# EAGLE design sanguish 2 (EAGLE 6.2)
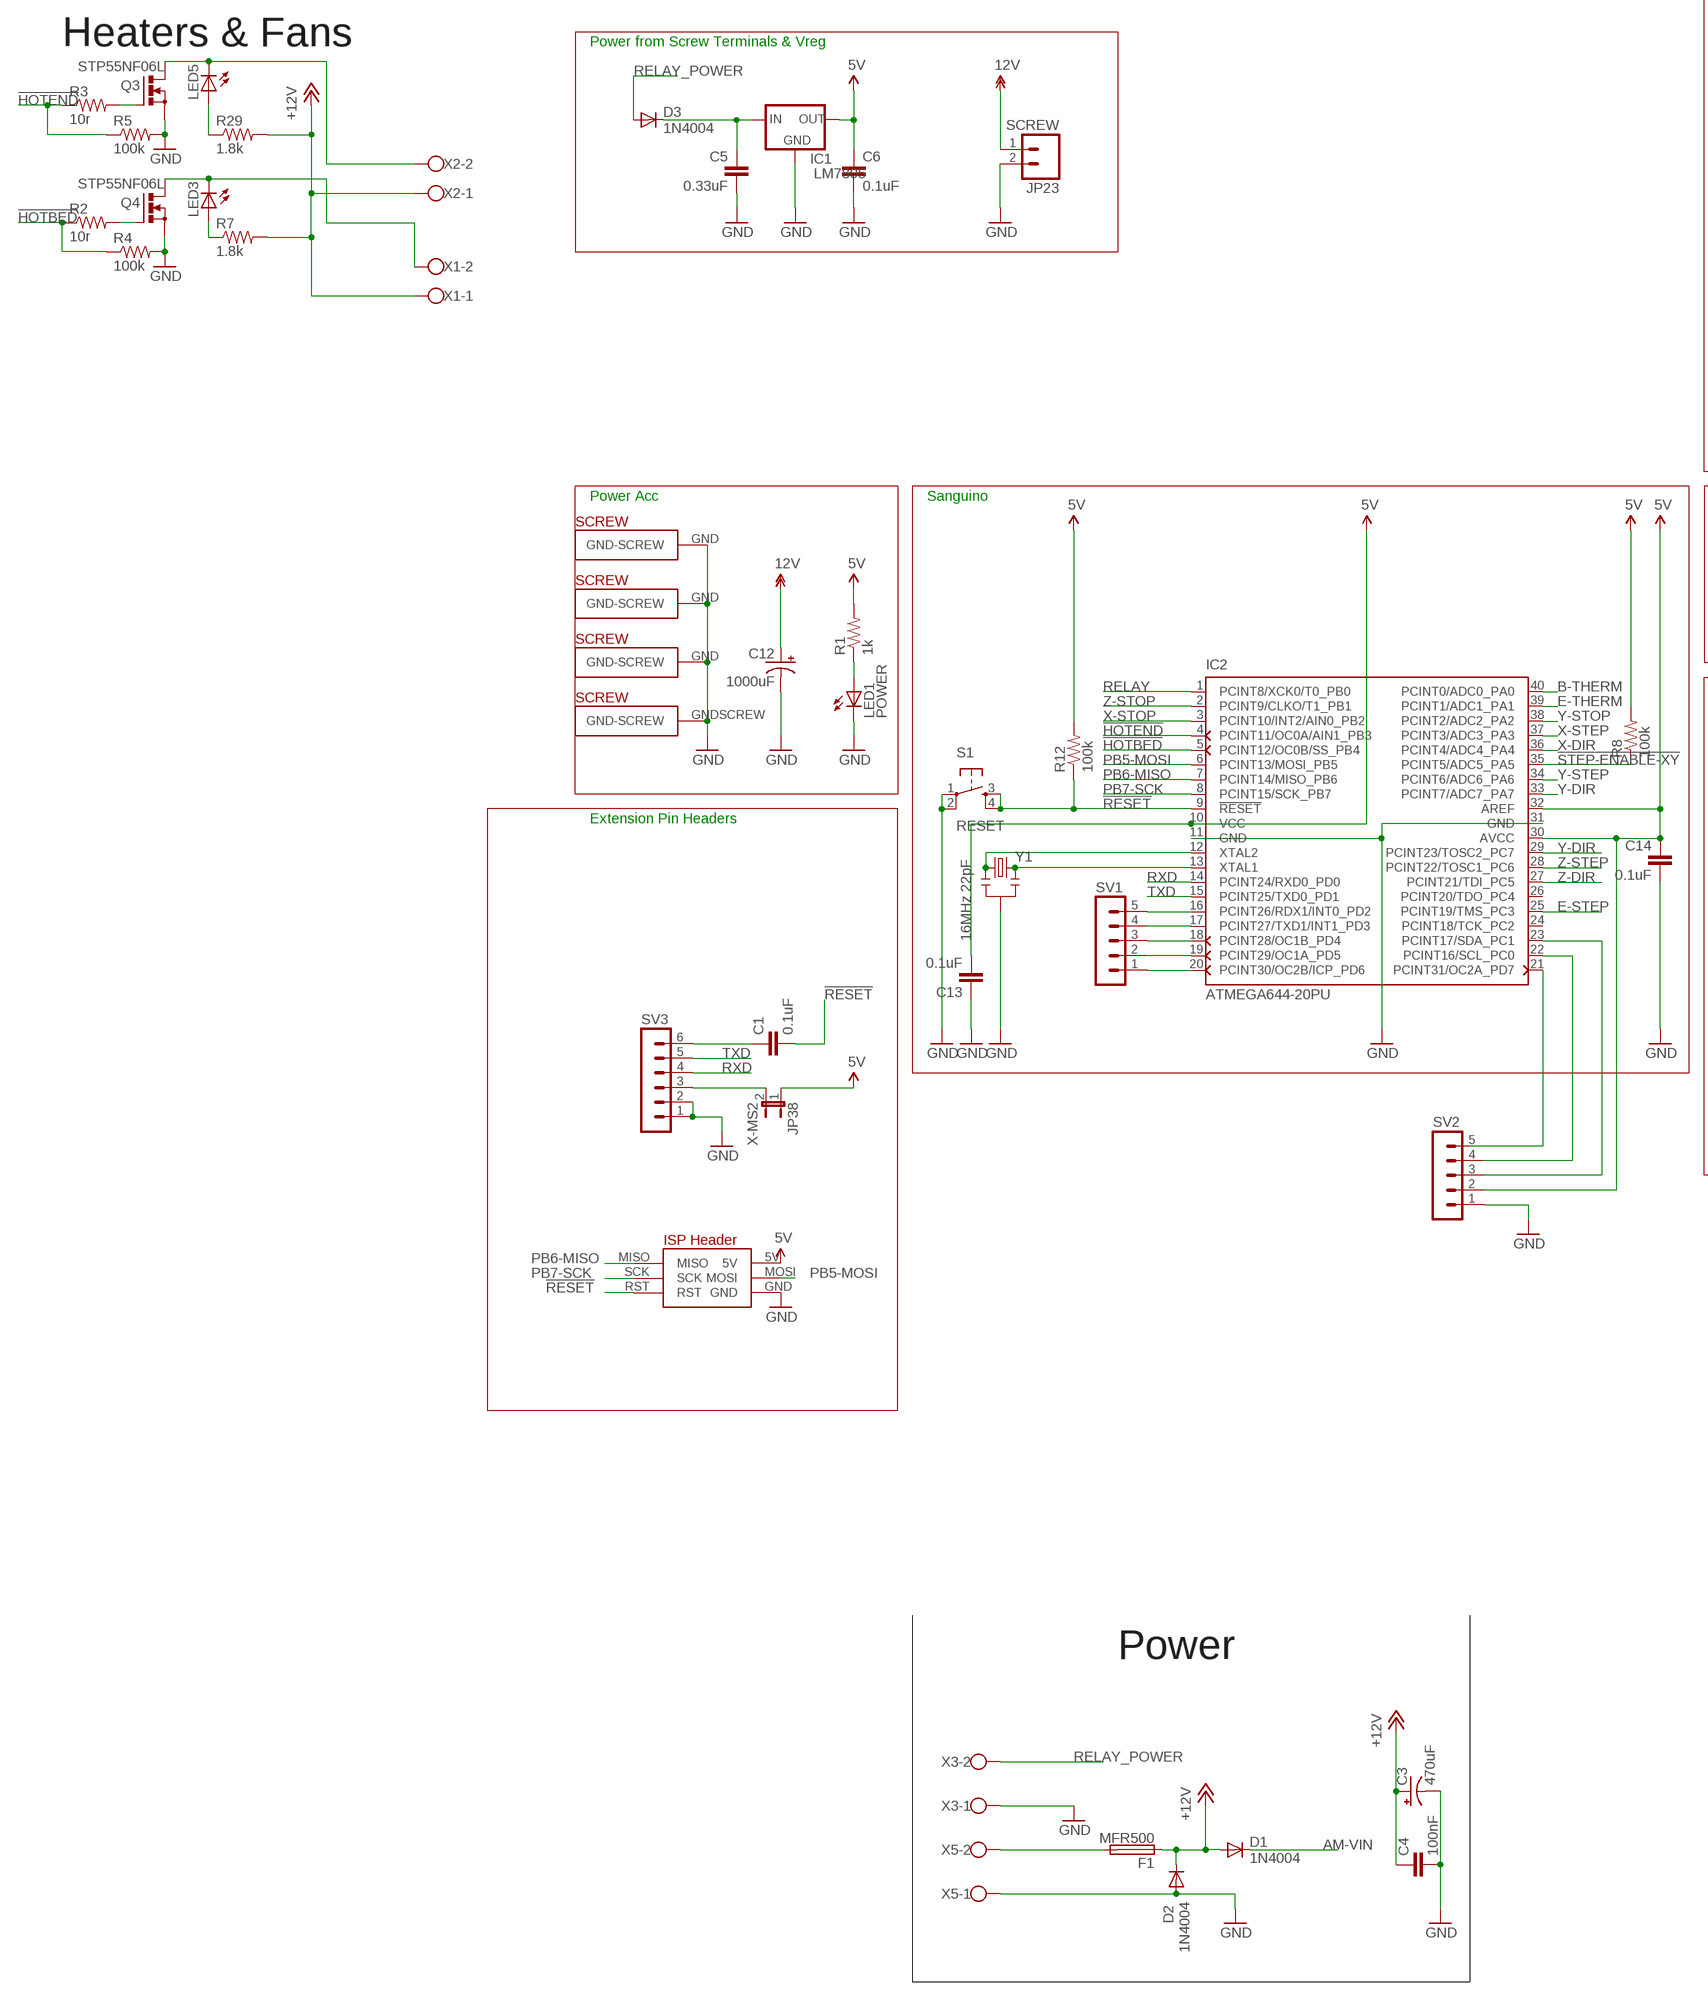
[diagram p0: schematic, sheet 1, part 1 of 2]
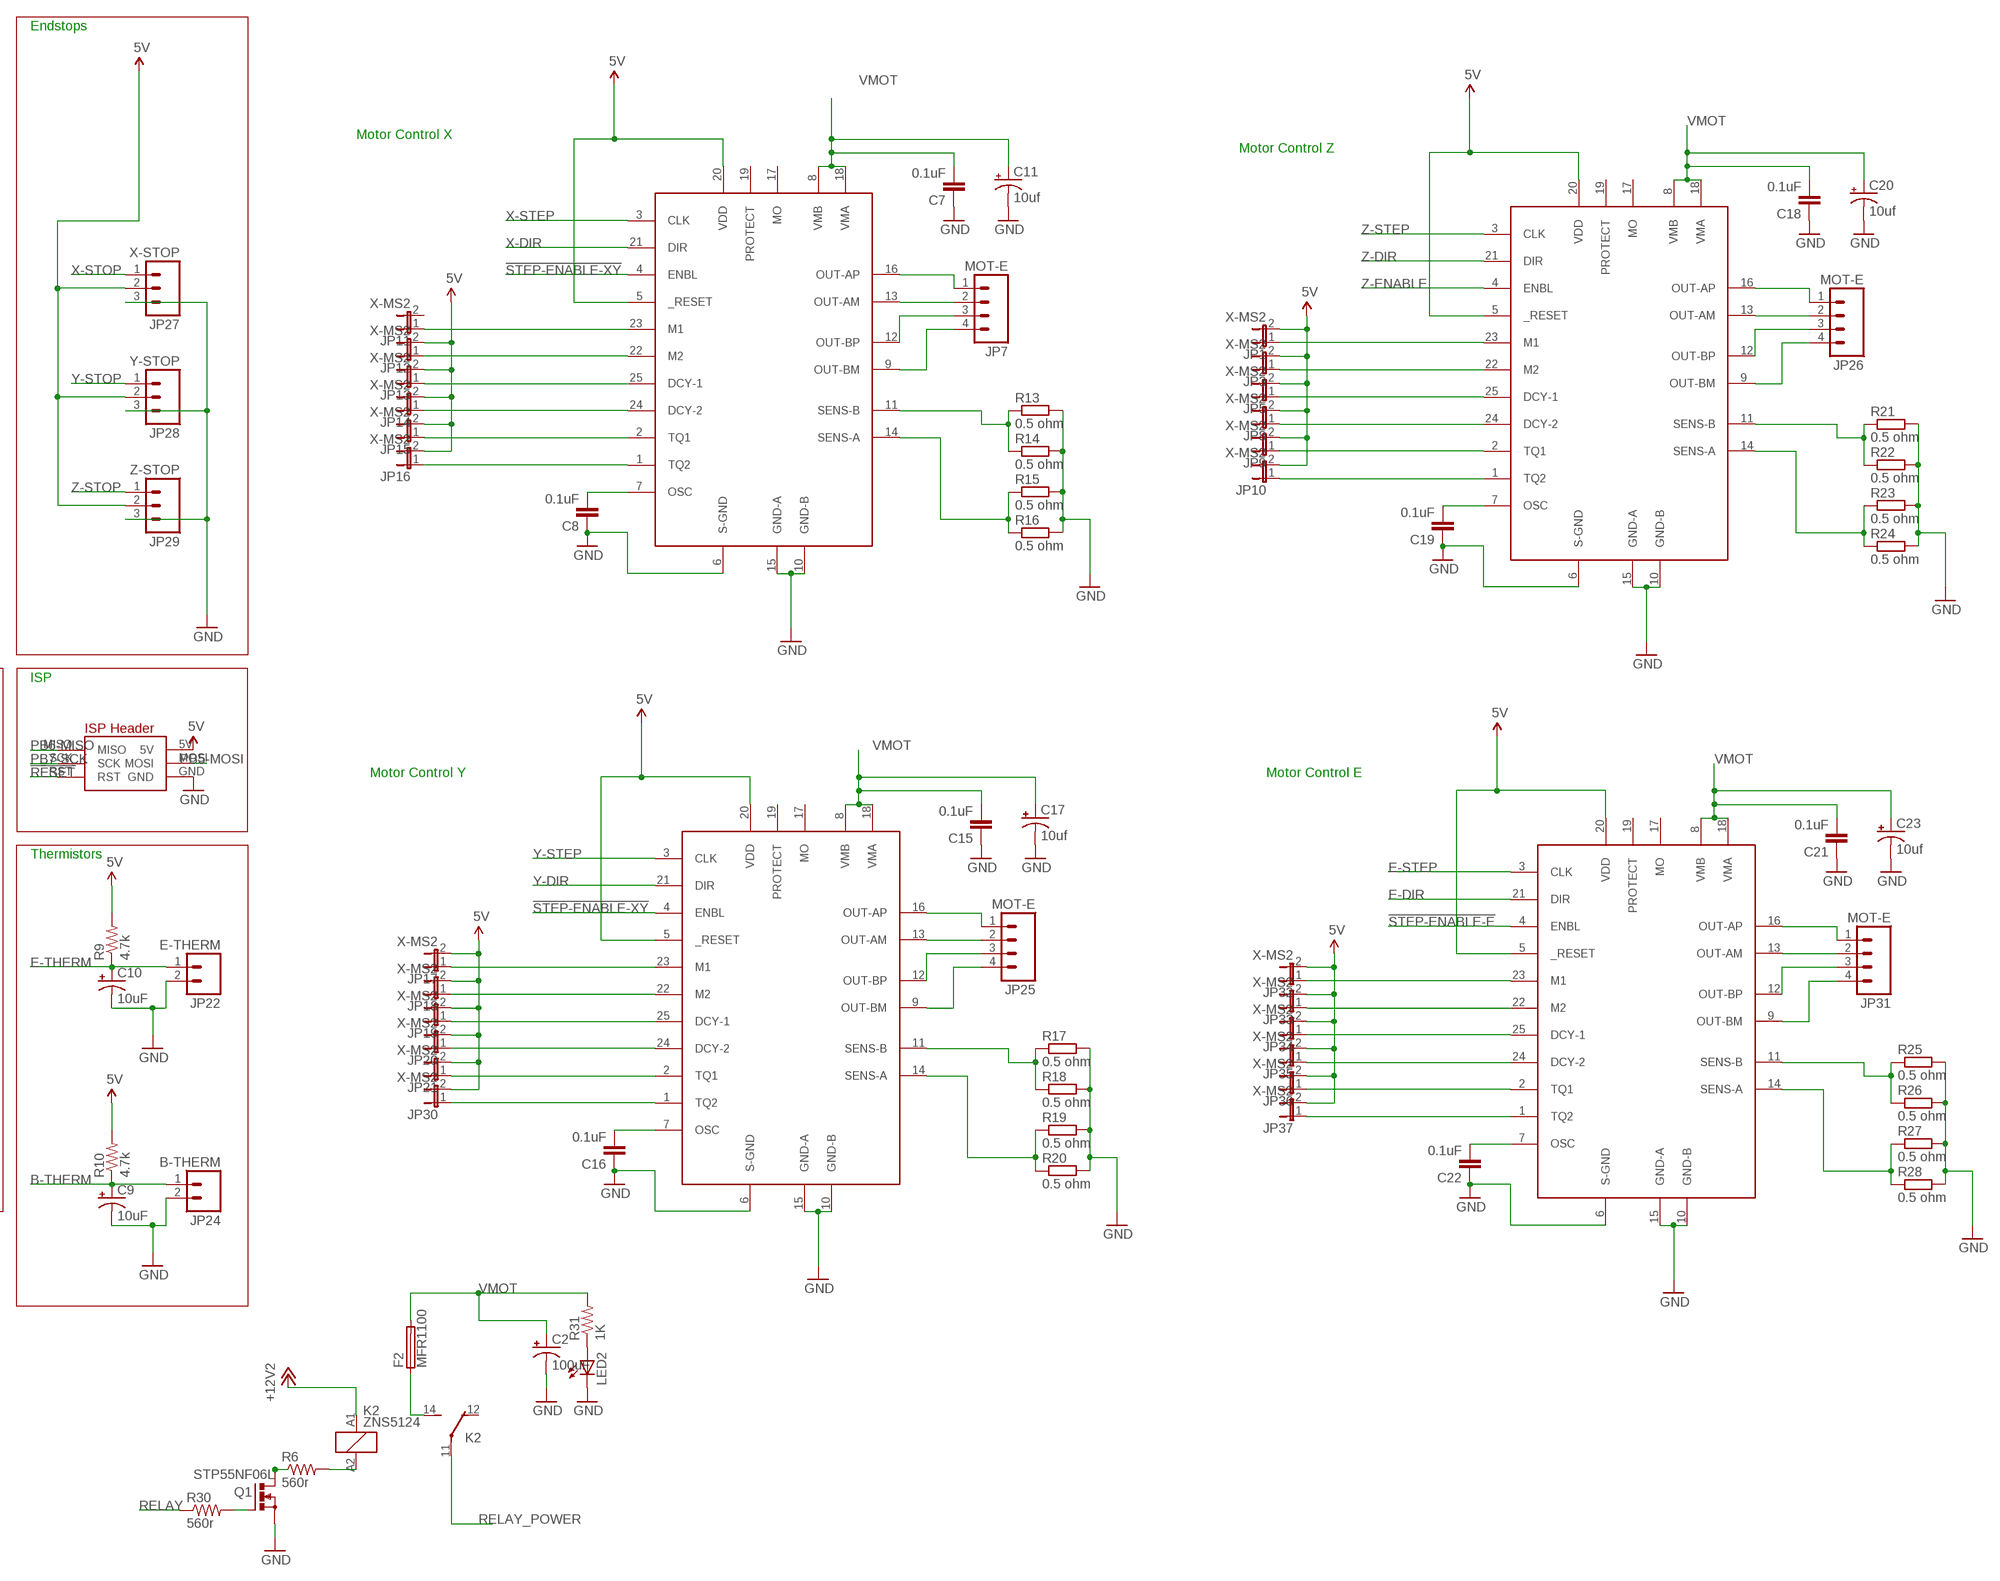
[diagram p1: schematic, sheet 1, part 2 of 2]

## Parts
C1  0.1uF  CAPPTH2  [CAP-PTH-SMALL2]
C2  100uF  CAP_POLPTH2  [CPOL-RADIAL-10UF-25V]
C3  470uF  CPOL-USE3.5-8  [E3,5-8]
C4  100nF  C2,5-3  [C2.5-3]
C5  0.33uF  CAPPTH2  [CAP-PTH-SMALL2]
C6  0.1uF  CAPPTH2  [CAP-PTH-SMALL2]
C7  0.1uF  CAPPTH2  [CAP-PTH-SMALL2]
C8  0.1uF  CAPPTH2  [CAP-PTH-SMALL2]
C9  10uF  CAP_POLPTH2  [CPOL-RADIAL-10UF-25V]
C10  10uF  CAP_POLPTH2  [CPOL-RADIAL-10UF-25V]
C11  10uf  CAP_POLPTH1  [CPOL-RADIAL-100UF-25V]
C12  1000uF  CAP_POLPTH4  [CPOL-RADIAL-1000UF-25V]
C13  0.1uF  CAPPTH2  [CAP-PTH-SMALL2]
C14  0.1uF  CAPPTH2  [CAP-PTH-SMALL2]
C15  0.1uF  CAPPTH2  [CAP-PTH-SMALL2]
C16  0.1uF  CAPPTH2  [CAP-PTH-SMALL2]
C17  10uf  CAP_POLPTH1  [CPOL-RADIAL-100UF-25V]
C18  0.1uF  CAPPTH2  [CAP-PTH-SMALL2]
C19  0.1uF  CAPPTH2  [CAP-PTH-SMALL2]
C20  10uf  CAP_POLPTH1  [CPOL-RADIAL-100UF-25V]
C21  0.1uF  CAPPTH2  [CAP-PTH-SMALL2]
C22  0.1uF  CAPPTH2  [CAP-PTH-SMALL2]
C23  10uf  CAP_POLPTH1  [CPOL-RADIAL-100UF-25V]
D1  1N4004  [DO41-10]
D2  1N4004  [DO41-10]
D3  1N4004  [DO41-10]
F1  MFR500  PTCFUSE  [MFR500]
F2  MFR1100  PTCFUSEMFR1100  [MFR1100]
IC1  LM7805  V_REG_78XX  [78XXL-CUSTOM]
IC2  ATMEGA644-20PU  [DIL40]
JP1  X-MS2  JUMPER-2PTH  [1X02]
JP3  X-MS2  JUMPER-2PTH  [1X02]
JP5  X-MS2  JUMPER-2PTH  [1X02]
JP7  MOT-E  M04POLAR  [MOLEX-1X4]
JP8  X-MS2  JUMPER-2PTH  [1X02]
JP9  X-MS2  JUMPER-2PTH  [1X02]
JP10  X-MS2  JUMPER-2PTH  [1X02]
JP11  X-MS2  JUMPER-2PTH  [1X02]
JP12  X-MS2  JUMPER-2PTH  [1X02]
JP13  X-MS2  JUMPER-2PTH  [1X02]
JP14  X-MS2  JUMPER-2PTH  [1X02]
JP15  X-MS2  JUMPER-2PTH  [1X02]
JP16  X-MS2  JUMPER-2PTH  [1X02]
JP17  X-MS2  JUMPER-2PTH  [1X02]
JP18  X-MS2  JUMPER-2PTH  [1X02]
JP19  X-MS2  JUMPER-2PTH  [1X02]
JP20  X-MS2  JUMPER-2PTH  [1X02]
JP21  X-MS2  JUMPER-2PTH  [1X02]
JP22  E-THERM  M02PTH  [1X02]
JP23  SCREW  M025MM  [SCREWTERMINAL-5MM-2]
JP24  B-THERM  M02PTH  [1X02]
JP25  MOT-E  M04POLAR  [MOLEX-1X4]
JP26  MOT-E  M04POLAR  [MOLEX-1X4]
JP27  X-STOP  M03POLAR  [MOLEX-1X3]
JP28  Y-STOP  M03POLAR  [MOLEX-1X3]
JP29  Z-STOP  M03POLAR  [MOLEX-1X3]
JP30  X-MS2  JUMPER-2PTH  [1X02]
JP31  MOT-E  M04POLAR  [MOLEX-1X4]
JP32  X-MS2  JUMPER-2PTH  [1X02]
JP33  X-MS2  JUMPER-2PTH  [1X02]
JP34  X-MS2  JUMPER-2PTH  [1X02]
JP35  X-MS2  JUMPER-2PTH  [1X02]
JP36  X-MS2  JUMPER-2PTH  [1X02]
JP37  X-MS2  JUMPER-2PTH  [1X02]
JP38  X-MS2  JUMPER-2PTH  [1X02]
K2  ZNS5124  [ZN5]
LED1  POWER  LED3MM  [LED3MM]
LED2  LED3MM  [LED3MM]
LED3  LED3MM  [LED3MM]
LED5  LED3MM  [LED3MM]
Q1  STP55NF06L  IRF512  [TO220BV]
Q3  STP55NF06L  IRF512  [TO220BV]
Q4  STP55NF06L  IRF512  [TO220BV]
R1  1k  RESISTORPTH1  [AXIAL-0.3]
R2  10r  R-US_0207/2V  [0207/2V]
R3  10r  R-US_0207/2V  [0207/2V]
R4  100k  R-US_0207/2V  [0207/2V]
R5  100k  R-US_0207/2V  [0207/2V]
R6  560r  R-US_0207/2V  [0207/2V]
R7  1.8k  R-US_0207/2V  [0207/2V]
R8  100k  RESISTORPTH1  [AXIAL-0.3]
R9  4.7k  RESISTORPTH1  [AXIAL-0.3]
R10  4.7k  RESISTORPTH1  [AXIAL-0.3]
R12  100k  RESISTORPTH1  [AXIAL-0.3]
R13  0.5 ohm  R-EU_0207/10  [0207/10]
R14  0.5 ohm  R-EU_0207/10  [0207/10]
R15  0.5 ohm  R-EU_0207/10  [0207/10]
R16  0.5 ohm  R-EU_0207/10  [0207/10]
R17  0.5 ohm  R-EU_0207/10  [0207/10]
R18  0.5 ohm  R-EU_0207/10  [0207/10]
R19  0.5 ohm  R-EU_0207/10  [0207/10]
R20  0.5 ohm  R-EU_0207/10  [0207/10]
R21  0.5 ohm  R-EU_0207/10  [0207/10]
R22  0.5 ohm  R-EU_0207/10  [0207/10]
R23  0.5 ohm  R-EU_0207/10  [0207/10]
R24  0.5 ohm  R-EU_0207/10  [0207/10]
R25  0.5 ohm  R-EU_0207/10  [0207/10]
R26  0.5 ohm  R-EU_0207/10  [0207/10]
R27  0.5 ohm  R-EU_0207/10  [0207/10]
R28  0.5 ohm  R-EU_0207/10  [0207/10]
R29  1.8k  R-US_0207/2V  [0207/2V]
R30  560r  R-US_0207/2V  [0207/2V]
R31  1K  R-US_0207/7  [0207/7]
S1  RESET  TAC_SWITCHPTH  [TACTILE-PTH]
SV1  MA05-1  [MA05-1]
SV2  MA05-1  [MA05-1]
SV3  MA06-1  [MA06-1]
U$10  IO_HEADERS_SCREW  [IO_HEADER-PLATEDSCREW]
U$17  PLATED-SCREW  [PLATEDSCREW]
U$21  TB6560  [ZIP25]
U$24  IO_HEADERS_SCREW  [IO_HEADER-PLATEDSCREW]
U$37  PLATED-SCREW  [PLATEDSCREW]
U$38  PLATED-SCREW  [PLATEDSCREW]
U$41  TB6560  [ZIP25]
U$43  TB6560  [ZIP25]
U$46  TB6560  [ZIP25]
X1  W237-102  [W237-102]
X2  W237-102  [W237-102]
X3  W237-102  [W237-102]
X5  W237-102  [W237-102]
Y1  16MHz 22pF  RESONATORPTH  [RESONATOR-PTH]

## Nets
5V: C6.1 C13.2 C14.1 IC1.OUT IC2.10(VCC) IC2.30(AVCC) IC2.32(AREF) JP1.2 JP3.2 JP5.2 JP8.2 JP9.2 JP10.2 JP12.2 JP13.2 JP14.2 JP15.2 JP16.2 JP17.2 JP18.2 JP19.2 JP20.2 JP21.2 JP27.2 JP28.2 JP29.2 JP30.2 JP32.2 JP33.2 JP34.2 JP35.2 JP36.2 JP37.2 JP38.1 R1.P$2 R8.P$2 R9.P$2 R10.P$2 R12.P$2 SV2.2 U$10.5V U$21.5(_RESET) U$21.20(VDD) U$24.5V U$41.5(_RESET) U$41.20(VDD) U$43.5(_RESET) U$43.20(VDD) U$46.5(_RESET) U$46.20(VDD)
12V: C12.1(+) JP23.1
!HOTBED: IC2.5(PCINT12/OC0B/SS_PB4) R2.1 R4.1
!HOTEND: IC2.4(PCINT11/OC0A/AIN1_PB3) R3.1 R5.1
!RESET: C1.2 IC2.9(!RESET) R12.P$1 S1.3 S1.4 U$10.RST U$24.RST
!STEP-ENABLE-E: U$46.4(ENBL)
!STEP-ENABLE-XY: IC2.35(PCINT5/ADC5_PA5) R8.P$1 U$21.4(ENBL) U$41.4(ENBL)
+12V: C3.+ C4.1 D1.A D2.C F1.1 K2.A1 R7.2 R29.2 X1.1 X2.1 ; supply symbol labelled +12V2
AM-VIN: D1.C
B-THERM: C9.1(+) IC2.40(PCINT0/ADC0_PA0) JP24.1 R10.P$1
E-DIR: U$46.21(DIR)
E-STEP: IC2.25(PCINT19/TMS_PC3) U$46.3(CLK)
E-THERM: C10.1(+) IC2.39(PCINT1/ADC1_PA1) JP22.1 R9.P$1
GND [Power]: C2.2(-) C3.- C4.2 C5.2 C6.2 C7.1 C8.1 C9.2(-) C10.2(-) C11.2(-) C12.2(-) C13.1 C14.2 C15.1 C16.1 C17.2(-) C18.1 C19.1 C20.2(-) C21.1 C22.1 C23.2(-) D2.A IC1.GND IC2.11(GND) IC2.31(GND) JP22.2 JP23.2 JP24.2 JP27.3 JP28.3 JP29.3 LED1.K(C) LED2.K(C) Q1.S Q3.S Q4.S R4.2 R5.2 R13.2 R14.2 R15.2 R16.2 R17.2 R18.2 R19.2 R20.2 R21.2 R22.2 R23.2 R24.2 R25.2 R26.2 R27.2 R28.2 S1.1 S1.2 SV2.1 SV3.1 SV3.2 U$10.GND U$17.GND(GND-SCREW) U$21.6(S-GND) U$21.10(GND-B) U$21.15(GND-A) U$24.GND U$24.GNDSCREW(GND-SCREW) U$37.GND(GND-SCREW) U$38.GND(GND-SCREW) U$41.6(S-GND) U$41.10(GND-B) U$41.15(GND-A) U$43.6(S-GND) U$43.10(GND-B) U$43.15(GND-A) U$46.6(S-GND) U$46.10(GND-B) U$46.15(GND-A) X3.1 X5.1 Y1.2
LED1: LED1.A R1.P$1
N$1: JP7.1 U$41.16(OUT-AP)
N$2: JP25.1 U$21.16(OUT-AP)
N$3: JP7.2 U$41.13(OUT-AM)
N$4: JP7.3 U$41.12(OUT-BP)
N$5: JP7.4 U$41.9(OUT-BM)
N$6: JP11.1 U$41.23(M1)
N$7: JP12.1 U$41.22(M2)
N$8: JP13.1 U$41.25(DCY-1)
N$9: JP14.1 U$41.24(DCY-2)
N$10: JP15.1 U$41.2(TQ1)
N$11: JP16.1 U$41.1(TQ2)
N$12: JP1.1 U$43.23(M1)
N$13: JP25.2 U$21.13(OUT-AM)
N$14: JP25.3 U$21.12(OUT-BP)
N$15: R13.1 R14.1 U$41.11(SENS-B)
N$16: R15.1 R16.1 U$41.14(SENS-A)
N$17: JP25.4 U$21.9(OUT-BM)
N$18: JP17.1 U$21.23(M1)
N$19: C8.2 U$41.7(OSC)
N$20: JP18.1 U$21.22(M2)
N$21: JP19.1 U$21.25(DCY-1)
N$22: JP20.1 U$21.24(DCY-2)
N$23: JP21.1 U$21.2(TQ1)
N$24: JP30.1 U$21.1(TQ2)
N$25: JP3.1 U$43.22(M2)
N$26: R17.1 R18.1 U$21.11(SENS-B)
N$27: R19.1 R20.1 U$21.14(SENS-A)
N$28: C16.2 U$21.7(OSC)
N$29: JP26.1 U$43.16(OUT-AP)
N$30: JP26.2 U$43.13(OUT-AM)
N$31: JP26.3 U$43.12(OUT-BP)
N$32: JP26.4 U$43.9(OUT-BM)
N$33: JP5.1 U$43.25(DCY-1)
N$34: JP8.1 U$43.24(DCY-2)
N$35: JP9.1 U$43.2(TQ1)
N$36: JP10.1 U$43.1(TQ2)
N$37: JP32.1 U$46.23(M1)
N$38: JP33.1 U$46.22(M2)
N$39: JP34.1 U$46.25(DCY-1)
N$40: R21.1 R22.1 U$43.11(SENS-B)
N$41: R23.1 R24.1 U$43.14(SENS-A)
N$42: C19.2 U$43.7(OSC)
N$43: JP31.1 U$46.16(OUT-AP)
N$44: JP31.2 U$46.13(OUT-AM)
N$45: JP31.3 U$46.12(OUT-BP)
N$46: JP31.4 U$46.9(OUT-BM)
N$47: JP35.1 U$46.24(DCY-2)
N$48: JP36.1 U$46.2(TQ1)
N$49: JP37.1 U$46.1(TQ2)
N$50: IC2.16(PCINT26/RDX1/INT0_PD2) SV1.5
N$51: IC2.17(PCINT27/TXD1/INT1_PD3) SV1.4
N$52: IC2.18(PCINT28/OC1B_PD4) SV1.3
N$53: IC2.19(PCINT29/OC1A_PD5) SV1.2
N$54: R25.1 R26.1 U$46.11(SENS-B)
N$55: R27.1 R28.1 U$46.14(SENS-A)
N$56: C22.2 U$46.7(OSC)
N$57: LED3.K(C) Q4.D X1.2
N$58: IC2.20(PCINT30/OC2B/ICP_PD6) SV1.1
N$59: LED5.K(C) Q3.D X2.2
N$60: Q4.G R2.2
N$61: Q3.G R3.2
N$62: IC2.21(PCINT31/OC2A_PD7)
N$63: IC2.22(PCINT16/SCL_PC0) SV2.4
N$64: LED3.A R7.1
N$65: LED5.A R29.1
N$66: Q1.D R6.1
N$67: Q1.G R30.2
N$68: C5.1 D3.C IC1.IN
N$69: IC2.23(PCINT17/SDA_PC1) SV2.3
N$70: C1.1 SV3.6
N$71: JP38.2 SV3.3
N$72: F2.1 K2.14(2:S)
N$73: K2.A2 R6.2
N$74: F1.2 X5.2
N$75: LED2.A R31.1
PB5-MOSI: IC2.6(PCINT13/MOSI_PB5) U$10.MOSI U$24.MOSI
PB6-MISO: IC2.7(PCINT14/MISO_PB6) U$10.MISO U$24.MISO
PB7-SCK: IC2.8(PCINT15/SCK_PB7) U$10.SCK U$24.SCK
RELAY: IC2.1(PCINT8/XCK0/T0_PB0) R30.1
RELAY_POWER: D3.A K2.11(2:P) X3.2
RXD: IC2.14(PCINT24/RXD0_PD0) SV3.4
TXD: IC2.15(PCINT25/TXD0_PD1) SV3.5
VMOT: C2.1(+) C7.2 C11.1(+) C15.2 C17.1(+) C18.2 C20.1(+) C21.2 C23.1(+) F2.2 R31.2 U$21.8(VMB) U$21.18(VMA) U$41.8(VMB) U$41.18(VMA) U$43.8(VMB) U$43.18(VMA) U$46.8(VMB) U$46.18(VMA)
X-DIR: IC2.36(PCINT4/ADC4_PA4) U$41.21(DIR)
X-STEP: IC2.37(PCINT3/ADC3_PA3) U$41.3(CLK)
X-STOP: IC2.3(PCINT10/INT2/AIN0_PB2) JP27.1
XTAL1: IC2.13(XTAL1) Y1.3
XTAL2: IC2.12(XTAL2) Y1.1
Y-DIR: IC2.29(PCINT23/TOSC2_PC7) IC2.33(PCINT7/ADC7_PA7) U$21.21(DIR)
Y-STEP: IC2.34(PCINT6/ADC6_PA6) U$21.3(CLK)
Y-STOP: IC2.38(PCINT2/ADC2_PA2) JP28.1
Z-DIR: IC2.27(PCINT21/TDI_PC5) U$43.21(DIR)
Z-ENABLE: U$43.4(ENBL)
Z-STEP: IC2.28(PCINT22/TOSC1_PC6) U$43.3(CLK)
Z-STOP: IC2.2(PCINT9/CLKO/T1_PB1) JP29.1
Unconnected: IC2.24(PCINT18/TCK_PC2) IC2.26(PCINT20/TDO_PC4) JP11.2 K2.12(2:O) SV2.5 U$10.5V1 U$10.12V U$10.A0 U$10.A1 U$10.A2 U$10.A3 U$10.A4 U$10.GND1 U$10.GND2 U$10.GNDSCREW(GND-SCREW) U$10.PWM U$10.RX1 U$10.SCL U$10.SDA U$10.TX1 U$21.17(MO) U$21.19(PROTECT) U$24.5V1 U$24.12V U$24.A0 U$24.A1 U$24.A2 U$24.A3 U$24.A4 U$24.GND1 U$24.GND2 U$24.PWM U$24.RX1 U$24.SCL U$24.SDA U$24.TX1 U$41.17(MO) U$41.19(PROTECT) U$43.17(MO) U$43.19(PROTECT) U$46.17(MO) U$46.19(PROTECT)

## Notes on the sheet
- Endstops
- Motor Control X
- Motor Control Z
- Heaters & Fans | Power from Screw Terminals & Vreg
- Power Acc | Sanguino | ISP
- Motor Control Y | Motor Control E
- Thermistors
- Extension Pin Headers
- Power

## Library data of the parts
C1 C5-C8 C13-C16 C18 C19 C21 C22 = SparkFun:CAP: Capacitor Standard 0603 ceramic capacitor, and 0.1" leaded capacitor.
C2 C9-C12 C17 C20 C23 = SparkFun:CAP_POL: Capacitor Polarized These are standard SMD and PTH capacitors. Normally 10uF, 47uF, and 100uF in electrolytic and tantalum varieties. Always verify the external diameter of the through hole cap, it varies with capacity, voltage, and manufacturer. The EIA devices should be standard.
C3 = adafruit:CPOL-US: POLARIZED CAPACITOR, American symbol
C4 = capacitor-wima:C: CAPACITOR naming: grid - package width
D1-D3 = diode:1N4004: DIODE general purpose rectifier, 1 A
F1 F2 = RepRapjr:PTCFUSE: LITTLEFUSE Picofuse/slow Littlefuse
IC1 = SparkFun:V_REG_78XX: Voltage Regulator Standard 7805 5V regulator. IGO (Input Ground Output). Spark Fun Electronics SKU : COM-00107
IC2 = atmel:ATMEGA644-*PU: 8-bit Microcontroller with 64K Bytes In-System Programmable Flash Auto generated by make-symbol-device-package-bsdl.ulp Rev. 34 Source: http://www.atmel.com/dyn/resources/prod_documents/doc2593.pdf; MPN: ATMEGA644-20PU; OC_FARNELL: 1288340; OC_NEWARK: 23M5060
JP1 JP3 JP5 JP8-JP21 JP30 JP32-JP38 = SparkFun:JUMPER-2: Jumper Basic 0.1" spaced jumper. Use with breakaway headers.
JP7 JP25 JP26 JP31 = SparkFun:M04: Header 4 Standard 4-pin 0.1" header. Use with straight break away headers (SKU : PRT-00116), right angle break away headers (PRT-00553), swiss pins (PRT-00743), machine pins (PRT-00117), and female headers (PRT-00115). Molex polarized connector foot print use with SKU : PRT-08231 with associated crimp pins and housings.
JP22-JP24 = SparkFun:M02: Header 2 Standard 2-pin 0.1" header. Use with straight break away headers (SKU : PRT-00116), right angle break away headers (PRT-00553), swiss pins (PRT-00743), machine pins (PRT-00117), and female headers (PRT-00115). Molex polarized connector foot print use with SKU : PRT-08233 with associated crimp pins and housings.
JP27-JP29 = SparkFun:M03: Header 3 Standard 3-pin 0.1" header. Use with straight break away headers (SKU : PRT-00116), right angle break away headers (PRT-00553), swiss pins (PRT-00743), machine pins (PRT-00117), and female headers (PRT-00115). Molex polarized connector foot print use with SKU : PRT-08232 with associated crimp pins and housings.
K2 = relay:ZNS5*: Miniature Power PCB Relay SCHRACK 1pole 10 A Source: http://www.schrack.com/.. 5847.pdf; OC_FARNELL: unknown; OC_NEWARK: unknown
LED1 = SparkFun:LED: LEDs Standard schematic elements and footprints for 5mm, 3mm, 1206, and 0603 sized LEDs. 5mm - Spark Fun Electronics SKU : COM-00529 (and others)
LED2 LED3 LED5 = led:LED: LED OSRAM: - CHIPLED LG R971, LG N971, LY N971, LG Q971, LY Q971, LO R971, LY R971 LH N974, LH R974 LS Q976, LO Q976, LY Q976 LO Q996 - Hyper CHIPLED LW Q18S LB Q993, LB Q99A, LB R99A - SideLED LS A670, LO A670, LY A670, LG A670, LP A670 LB A673, LV A673, LT A673, LW A673 LH A674 LY A675 LS A676, LA A676, LO A676, LY A676, LW A676 LS A679, LY A679, LG A679 - Hyper Micro SIDELED® LS Y876, LA Y876, LO Y876, LY Y876 LT Y87S - SmartLED LW L88C, LW L88S LB L89C, LB L89S, LG L890 LS L89K, LO L89K, LY L89K LS L896, LA L896, LO L896, LY L896 - TOPLED LS T670, LO T670, LY T670, LG T670, LP T670 LSG T670, LSP T670, LSY T670, LOP T670, LYG T670 LG T671, LOG T671, LSG T671 LB T673, LV T673, LT T673, LW T673 LH T674 LS T676, LA T676, LO T676, LY T676, LB T676, LH T676, LSB T676, LW T676 LB T67C, LV T67C, LT T67C, LS T67K, LO T67K, LY T67K, LW E67C LS E67B, LA E67B, LO E67B, LY E67B, LB E67C, LV E67C, LT E67C LW T67C LS T679, LY T679, LG T679 LS T770, LO T770, LY T770, LG T770, LP T770 LB T773, LV T773, LT T773, LW T773 LH T774 LS E675, LA E675, LY E675, LS T675 LS T776, LA T776, LO T776, LY T776, LB T776 LHGB T686 LT T68C, LB T68C - Hyper Mini TOPLED® LB M676 - Mini TOPLED Santana® LG M470 LS M47K, LO M47K, LY M47K Source: http://www.osram.convergy.de LUXEON: - LUMILED® LXK2-PW12-R00, LXK2-PW12-S00, LXK2-PW14-U00, LXK2-PW14-V00 LXK2-PM12-R00, LXK2-PM12-S00, LXK2-PM14-U00 LXK2-PE12-Q00, LXK2-PE12-R00, LXK2-PE12-S00, LXK2-PE14-T00, LXK2-PE14-U00 LXK2-PB12-K00, LXK2-PB12-L00, LXK2-PB12-M00, LXK2-PB14-N00, LXK2-PB14-P00, LXK2-PB14-Q00 LXK2-PR12-L00, LXK2-PR12-M00, LXK2-PR14-Q00, LXK2-PR14-R00 LXK2-PD12-Q00, LXK2-PD12-R00, LXK2-PD12-S00 LXK2-PH12-R00, LXK2-PH12-S00 LXK2-PL12-P00, LXK2-PL12-Q00, LXK2-PL12-R00 Source: www.luxeon.com KINGBRIGHT: KA-3528ASYC Source: www.kingbright.com
Q1 Q3 Q4 = transistor-power:IRF512: N-CHANNEL MOS FET
R1 R8-R10 R12 = SparkFun:RESISTOR: Resistor Basic schematic elements and footprints for 0603, 1206, and PTH 1/10th watt (small) resistors.
R2-R7 R29 R30 = resistor:R-US_: RESISTOR, American symbol
R13-R28 = resistor:R-EU_: RESISTOR, European symbol
R31 = adafruit:R-US_: RESISTOR, American symbol
S1 = SparkFun:TAC_SWITCH: Momentary Switch Button commonly used for reset or general input. Spark Fun Electronics SKU : COM-00097
SV1 SV2 = con-lstb:MA05-1: PIN HEADER; OC_FARNELL: unknown; OC_NEWARK: unknown
SV3 = con-lstb:MA06-1: PIN HEADER; OC_FARNELL: unknown; OC_NEWARK: unknown
U$10 U$24 = Sanguinololu:IO_HEADERS_SCREW
U$17 U$37 U$38 = Sanguinololu:PLATED-SCREW
U$21 U$41 U$43 U$46 = tb6560:TB6560
X1-X3 X5 = con-wago-500:W237-102: WAGO SCREW CLAMP; MPN: 237-102; OC_FARNELL: unknown; OC_NEWARK: 70K9898
Y1 = SparkFun:RESONATOR: Resonator Small SMD resonator. This is the itty bitty 10/20MHz resonators with built in caps. CSTCE10M0G55 and CSTCE20M0V53. Footprint has been reviewed closely but hasn't been tested yet.

## Net classes
0 default: width 0.178 mm, drill 0.406 mm, clearance 0.178 mm
1 Power: width 0.3 mm, drill 0.406 mm, clearance 0.178 mm

## Board
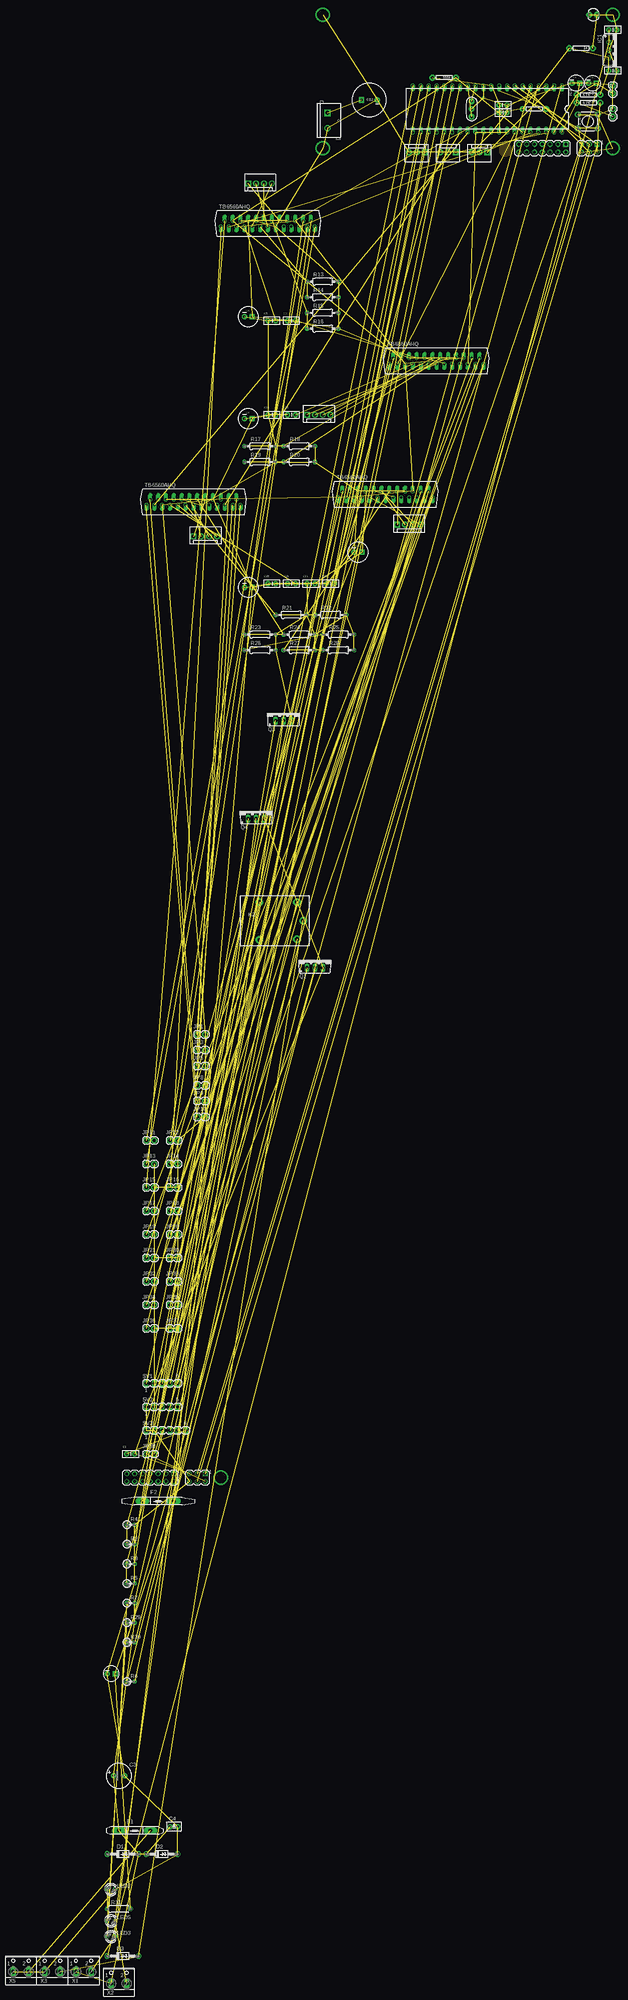
[diagram p2: board, top side]
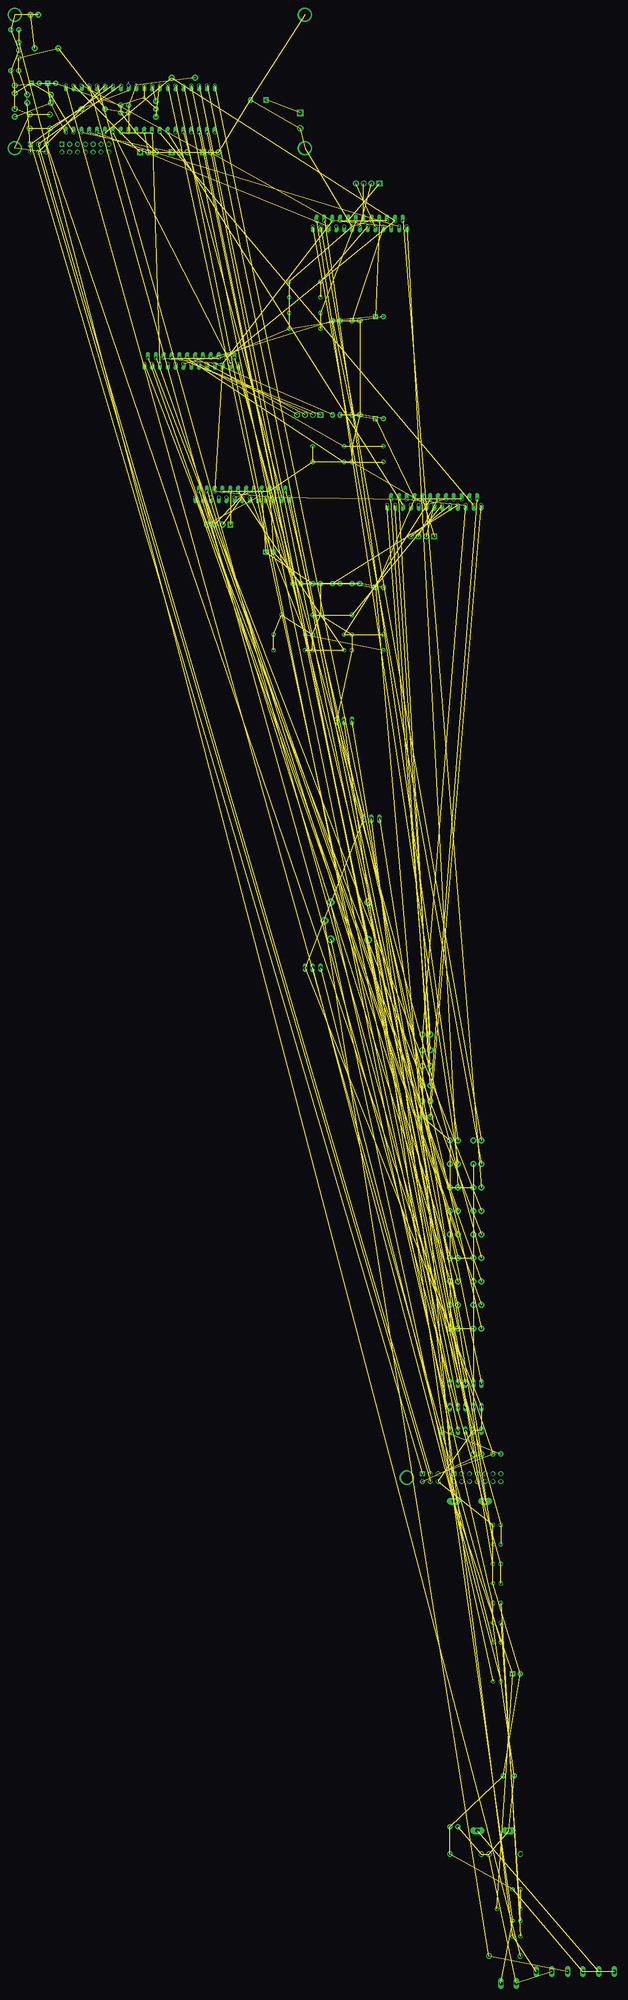
[diagram p3: board, bottom side, seen from below]

No outline drawn. Coordinates in mm, seen from the top.
Copper layers (1*16): Top 0.035mm / dielectric 1.5mm / Bottom 0.035mm
Design rules: minimum track width 10mil, minimum drill 20mil, track to track 10mil, track to pad 10mil, pad to pad 10mil, via to via 10mil, smd to smd 0mil, copper to edge 10mil, drill to drill 10mil, minimum pad ring 10mil, minimum via ring 10mil, stop-mask expansion 2mil, vias tented up to drill 25mil, thermal gap 10mil

### Footprints (pad centres in the part's own frame; a part is rotated, then mirrored left to right if it is on the bottom)
CAP-PTH-SMALL2 = drill 0.7 pad 1.651: 1 0,0; 2 2.54,0
CPOL-RADIAL-10UF-25V = drill 0.7 pad 1.651 square: 1 1.27,0 | drill 0.7 pad 1.651: 2 -1.27,0
E3,5-8 = drill 0.813 pad 1.6: + -1.778,0 | drill 0.813 pad 1.6 octagon: - 1.778,0
C2.5-3 = drill 0.813 pad 1.6 octagon: 1 -1.27,0; 2 1.27,0
CPOL-RADIAL-100UF-25V = drill 0.7 pad 1.651 square: 1 1.27,0 | drill 0.7 pad 1.651: 2 -1.27,0
CPOL-RADIAL-1000UF-25V = drill 0.7 pad 1.651 square: 1 2.54,0 | drill 0.7 pad 1.651: 2 -2.54,0
DO41-10 = drill 1.118: A 5.08,0; C -5.08,0
MFR500 = drill 1.2 pad 2.3 long: 1 -5.08,0; 2 5.08,0
MFR1100 = drill 1.2 pad 2.3 long: 1 -5.08,0; 2 5.08,0
78XXL-CUSTOM = drill 1.016: GND 0,0; IN -2.54,0; OUT 2.54,0
DIL40 = drill 0.813 offset: 1 -24.13,-7.62; 2 -21.59,-7.62; 3 -19.05,-7.62; 4 -16.51,-7.62; 5 -13.97,-7.62; 6 -11.43,-7.62; 7 -8.89,-7.62; 8 -6.35,-7.62; 9 -3.81,-7.62; 10 -1.27,-7.62; 11 1.27,-7.62; 12 3.81,-7.62; 13 6.35,-7.62; 14 8.89,-7.62; 15 11.43,-7.62; 16 13.97,-7.62; 17 16.51,-7.62; 18 19.05,-7.62; 19 21.59,-7.62; 20 24.13,-7.62; 21 24.13,7.62; 22 21.59,7.62; 23 19.05,7.62; 24 16.51,7.62; 25 13.97,7.62; 26 11.43,7.62; 27 8.89,7.62; 28 6.35,7.62; 29 3.81,7.62; 30 1.27,7.62; 31 -1.27,7.62; 32 -3.81,7.62; 33 -6.35,7.62; 34 -8.89,7.62; 35 -11.43,7.62; 36 -13.97,7.62; 37 -16.51,7.62; 38 -19.05,7.62; 39 -21.59,7.62; 40 -24.13,7.62
1X02 = drill 1.016 pad 1.88: 1 0,0; 2 2.54,0
MOLEX-1X4 = drill 1.016 pad 1.88 square: 1 0,0 | drill 1.016 pad 1.88: 2 2.54,0; 3 5.08,0; 4 7.62,0
SCREWTERMINAL-5MM-2 = drill 1.3 pad 2.032 square: 1 0,0 | drill 1.3 pad 2.032: 2 5,0
MOLEX-1X3 = drill 1.016 pad 1.88 square: 1 0,0 | drill 1.016 pad 1.88: 2 2.54,0; 3 5.08,0
ZN5 = drill 1.3 pad 2.5: 11 8.89,0; 12 -5.31,-6.2; 14 -5.31,6; A1 6.89,6; A2 6.89,-6
LED3MM = drill 0.813 pad 1.88: A -1.27,0; K 1.27,0
LED3MM' = drill 0.813 octagon: A -1.27,0; K 1.27,0
TO220BV = drill 1.016 long: D 0,-2.54; G -2.54,-2.54; S 2.54,-2.54
AXIAL-0.3 = drill 0.9 pad 1.88: P$1 -3.81,0; P$2 3.81,0
0207/2V = drill 0.813 octagon: 1 -1.27,0; 2 1.27,0
0207/10 = drill 0.813 octagon: 1 -5.08,0; 2 5.08,0
0207/7 = drill 0.813 octagon: 1 -3.81,0; 2 3.81,0
TACTILE-PTH = drill 1.016 pad 1.88: 1 -3.251,2.261; 2 3.251,2.261; 3 -3.251,-2.261; 4 3.251,-2.261
MA05-1 = drill 1.016 long: 1 -5.08,0; 2 -2.54,0; 3 0,0; 4 2.54,0; 5 5.08,0
MA06-1 = drill 1.016 long: 1 -6.35,0; 2 -3.81,0; 3 -1.27,0; 4 1.27,0; 5 3.81,0; 6 6.35,0
IO_HEADER-PLATEDSCREW = drill 1: 5V -5.08,-1.27; 5V1 -27.94,1.27; 12V -30.48,1.27; A0 -15.24,-1.27; A1 -17.78,-1.27; A2 -20.32,-1.27; A3 -22.86,-1.27; A4 -25.4,-1.27; GND -10.16,-1.27; GND1 -27.94,-1.27; GND2 -30.48,-1.27; MOSI -7.62,-1.27; PWM -25.4,1.27; RST -10.16,1.27; RX1 -20.32,1.27; SCK -7.62,1.27; SDA -17.78,1.27; TX1 -22.86,1.27 | drill 3.6: GNDSCREW 0,0 | drill 1 square: MISO -5.08,1.27; SCL -15.24,1.27
PLATEDSCREW = drill 3.6: GND 0,0
ZIP25 = drill 0.8 pad 1.27 offset: 1 -15.24,0; 2 -13.97,1.905; 3 -12.7,0; 4 -11.43,1.905; 5 -10.16,0; 6 -8.89,1.905; 7 -7.62,0; 8 -6.35,1.905; 9 -5.08,0; 10 -3.81,1.905; 11 -2.54,0; 12 -1.27,1.905; 13 0,0; 14 1.27,1.905; 15 2.54,0; 16 3.81,1.905; 17 5.08,0; 18 6.35,1.905; 19 7.62,0; 20 8.89,1.905; 21 10.16,0; 22 11.43,1.905; 23 12.7,0; 24 13.97,1.905; 25 15.24,0
W237-102 = drill 1.194 long: 1 -2.5,-1.27; 2 2.5,-1.27
RESONATOR-PTH = drill 0.8 pad 1.88: 1 -2.54,0; 2 0,0; 3 2.54,0

### Placement (x,y rotation side)
C1  -59.69,-419.1 0 top
C2  -64.77,-490.22 0 top
C3  -62.23,-523.24 0 top
C4  -44.45,-539.75 0 top
C5  96.52,42.16 0 top
C6  96.52,28.96 0 top
C7  -7.62,-52.07 0 top
C8  -13.97,-52.07 0 top
C9  85.85,24.89 0 top
C10  91.19,24.88 0 top
C11  -20.32,-50.8 0 top
C12  18.92,19.43 180 top
C13  63.5,17.78 180 top
C14  60.96,15.24 0 top
C15  -13.97,-82.55 0 top
C16  -7.62,-82.55 0 top
C17  -20.32,-83.82 0 top
C18  -13.97,-137.16 0 top
C19  -7.62,-137.16 0 top
C20  15.24,-127 0 top
C21  -1.27,-137.16 0 top
C22  5.08,-137.16 0 top
C23  -20.32,-138.43 0 top
D1  -60.96,-548.64 0 top
D2  -48.26,-548.64 0 top
D3  -60.96,-581.66 0 top
F1  -57.15,-541.02 0 top
F2  -49.53,-434.34 0 top
IC1  96.52,35.56 270 top
IC2  57.15,16.51 180 top
JP1  -36.83,-283.21 0 top
JP3  -36.83,-288.29 0 top
JP5  -36.83,-293.37 0 top
JP7  -20.32,-7.62 0 top
JP8  -36.83,-299.72 0 top
JP9  -36.83,-304.8 0 top
JP10  -36.83,-309.88 0 top
JP11  -53.34,-317.5 0 top
JP12  -45.72,-317.5 0 top
JP13  -53.34,-325.12 0 top
JP14  -45.72,-325.12 0 top
JP15  -53.34,-332.74 0 top
JP16  -45.72,-332.74 0 top
JP17  -53.34,-340.36 0 top
JP18  -45.72,-340.36 0 top
JP19  -53.34,-347.98 0 top
JP20  -45.72,-347.98 0 top
JP21  -53.34,-355.6 0 top
JP22  97.79,21.59 90 top
JP23  5.33,15.24 270 top
JP24  97.79,13.97 90 top
JP25  -1.27,-82.55 0 top
JP26  -38.1,-121.92 0 top
JP27  36.83,2.54 180 top
JP28  46.99,2.54 180 top
JP29  57.15,2.54 180 top
JP30  -45.72,-355.6 0 top
JP31  27.94,-118.11 0 top
JP32  -53.34,-363.22 0 top
JP33  -45.72,-363.22 0 top
JP34  -53.34,-370.84 0 top
JP35  -45.72,-370.84 0 top
JP36  -53.34,-378.46 0 top
JP37  -45.72,-378.46 0 top
JP38  -53.34,-419.1 0 top
K2  -11.43,-246.38 0 top
LED1  91.44,46.99 180 top
LED2  [LED3MM']  -64.77,-560.07 0 top
LED3  [LED3MM']  -64.77,-575.31 0 top
LED5  [LED3MM']  -64.77,-570.23 0 top
Q1  1.27,-259.08 0 top
Q3  -8.89,-179.07 0 top
Q4  -17.78,-210.82 0 top
R1  87.5,36.2 180 top
R2  -58.42,-448.31 0 top
R3  -58.42,-454.66 0 top
R4  -58.42,-441.96 0 top
R5  -58.42,-461.01 0 top
R6  -58.42,-492.76 0 top
R7  -58.42,-467.36 0 top
R8  43.18,26.67 180 top
R9  89.92,21.08 0 top
R10  89.92,18.54 0 top
R12  72.39,16.51 180 top
R13  3.81,-39.37 0 top
R14  3.81,-44.45 0 top
R15  3.81,-49.53 0 top
R16  3.81,-54.61 0 top
R17  -16.51,-92.71 0 top
R18  -3.81,-92.71 0 top
R19  -16.51,-97.79 0 top
R20  -3.81,-97.79 0 top
R21  -6.35,-147.32 0 top
R22  6.35,-147.32 0 top
R23  -16.51,-153.67 0 top
R24  -3.81,-153.67 0 top
R25  8.89,-153.67 0 top
R26  -16.51,-158.75 0 top
R27  -3.81,-158.75 0 top
R28  8.89,-158.75 0 top
R29  -58.42,-473.71 0 top
R30  -58.42,-480.06 0 top
R31  -62.23,-566.42 0 top
S1  89.68,12.46 0 top
SV1  -48.26,-396.24 0 top
SV2  -48.26,-403.86 0 top
SV3  -46.99,-411.48 0 top
U$10  -29.21,-426.72 0 top
U$17  3.81,3.81 0 top
U$21  40.64,-66.04 0 top
U$24  97.79,3.81 0 top
U$37  3.81,46.99 0 top
U$38  97.79,46.99 0 top
U$41  -13.97,-21.59 0 top
U$43  -38.1,-111.76 0 top
U$46  24.13,-109.22 0 top
X1  -73.66,-585.47 0 top
X2  -62.23,-589.28 0 top
X3  -83.82,-585.47 0 top
X5  -93.98,-585.47 0 top
Y1  52.07,16.51 270 top

### Tracks (layer width: path | path; a pad name or v marks a point on that pad's centre or on a via)
5V  (48 unrouted)
  Bottom 0.254: R10.P$2 R9.P$2
12V  (1 unrouted)
!HOTBED  (2 unrouted)
!HOTEND  (2 unrouted)
!RESET  (6 unrouted)
  Bottom 0.254: 60.96,22.35 IC2.9 60.96,25.4
!STEP-ENABLE-XY  (3 unrouted)
+12V  (9 unrouted)
B-THERM  (3 unrouted)
E-STEP  (1 unrouted)
E-THERM  (3 unrouted)
GND  (via drill 0.51 pad 1.02)  (81 unrouted)
  other vias: 55.88,20.19
LED1  (1 unrouted)
N$1  (1 unrouted)
N$2  (1 unrouted)
  pour Top: 63.02,6.1 61.59,4.66 arc270 64.46,4.66
N$3  (1 unrouted)
N$4  (1 unrouted)
N$5  (1 unrouted)
N$6  (1 unrouted)
N$7  (1 unrouted)
N$8  (1 unrouted)
N$9  (1 unrouted)
N$10  (1 unrouted)
N$11  (1 unrouted)
N$12  (1 unrouted)
N$13  (1 unrouted)
N$14  (1 unrouted)
N$15  (2 unrouted)
N$16  (2 unrouted)
N$17  (1 unrouted)
N$18  (1 unrouted)
N$19  (1 unrouted)
N$20  (1 unrouted)
N$21  (1 unrouted)
N$22  (1 unrouted)
N$23  (1 unrouted)
N$24  (1 unrouted)
N$25  (1 unrouted)
N$26  (2 unrouted)
N$27  (2 unrouted)
N$28  (1 unrouted)
N$29  (1 unrouted)
N$30  (1 unrouted)
N$31  (1 unrouted)
N$32  (1 unrouted)
N$33  (1 unrouted)
N$34  (1 unrouted)
N$35  (1 unrouted)
N$36  (1 unrouted)
N$37  (1 unrouted)
N$38  (1 unrouted)
N$39  (1 unrouted)
N$40  (2 unrouted)
N$41  (2 unrouted)
N$42  (1 unrouted)
N$43  (1 unrouted)
N$44  (1 unrouted)
N$45  (1 unrouted)
N$46  (1 unrouted)
N$47  (1 unrouted)
N$48  (1 unrouted)
N$49  (1 unrouted)
N$50  (1 unrouted)
N$51  (1 unrouted)
N$52  (1 unrouted)
N$53  (1 unrouted)
N$54  (2 unrouted)
N$55  (2 unrouted)
N$56  (1 unrouted)
N$57  (2 unrouted)
N$58  (1 unrouted)
N$59  (2 unrouted)
N$60  (1 unrouted)
N$61  (1 unrouted)
N$63  (1 unrouted)
N$64  (1 unrouted)
N$65  (1 unrouted)
N$66  (1 unrouted)
N$67  (1 unrouted)
N$68  (2 unrouted)
N$69  (1 unrouted)
N$70  (1 unrouted)
N$71  (1 unrouted)
N$72  (1 unrouted)
N$73  (1 unrouted)
N$74  (1 unrouted)
N$75  (1 unrouted)
PB5-MOSI  (2 unrouted)
PB6-MISO  (2 unrouted)
PB7-SCK  (2 unrouted)
RELAY  (1 unrouted)
RELAY_POWER  (2 unrouted)
RXD  (1 unrouted)
TXD  (1 unrouted)
VMOT  (18 unrouted)
X-DIR  (1 unrouted)
X-STEP  (1 unrouted)
X-STOP  (1 unrouted)
XTAL1  (1 unrouted)
XTAL2  (1 unrouted)
Y-DIR  (2 unrouted)
Y-STEP  (1 unrouted)
Y-STOP  (1 unrouted)
Z-DIR  (1 unrouted)
Z-STEP  (1 unrouted)
Z-STOP  (1 unrouted)